# Altium schematic sheet Ethernet.SchDoc
size A3; SheetNumber: 6; SheetTotal: 15
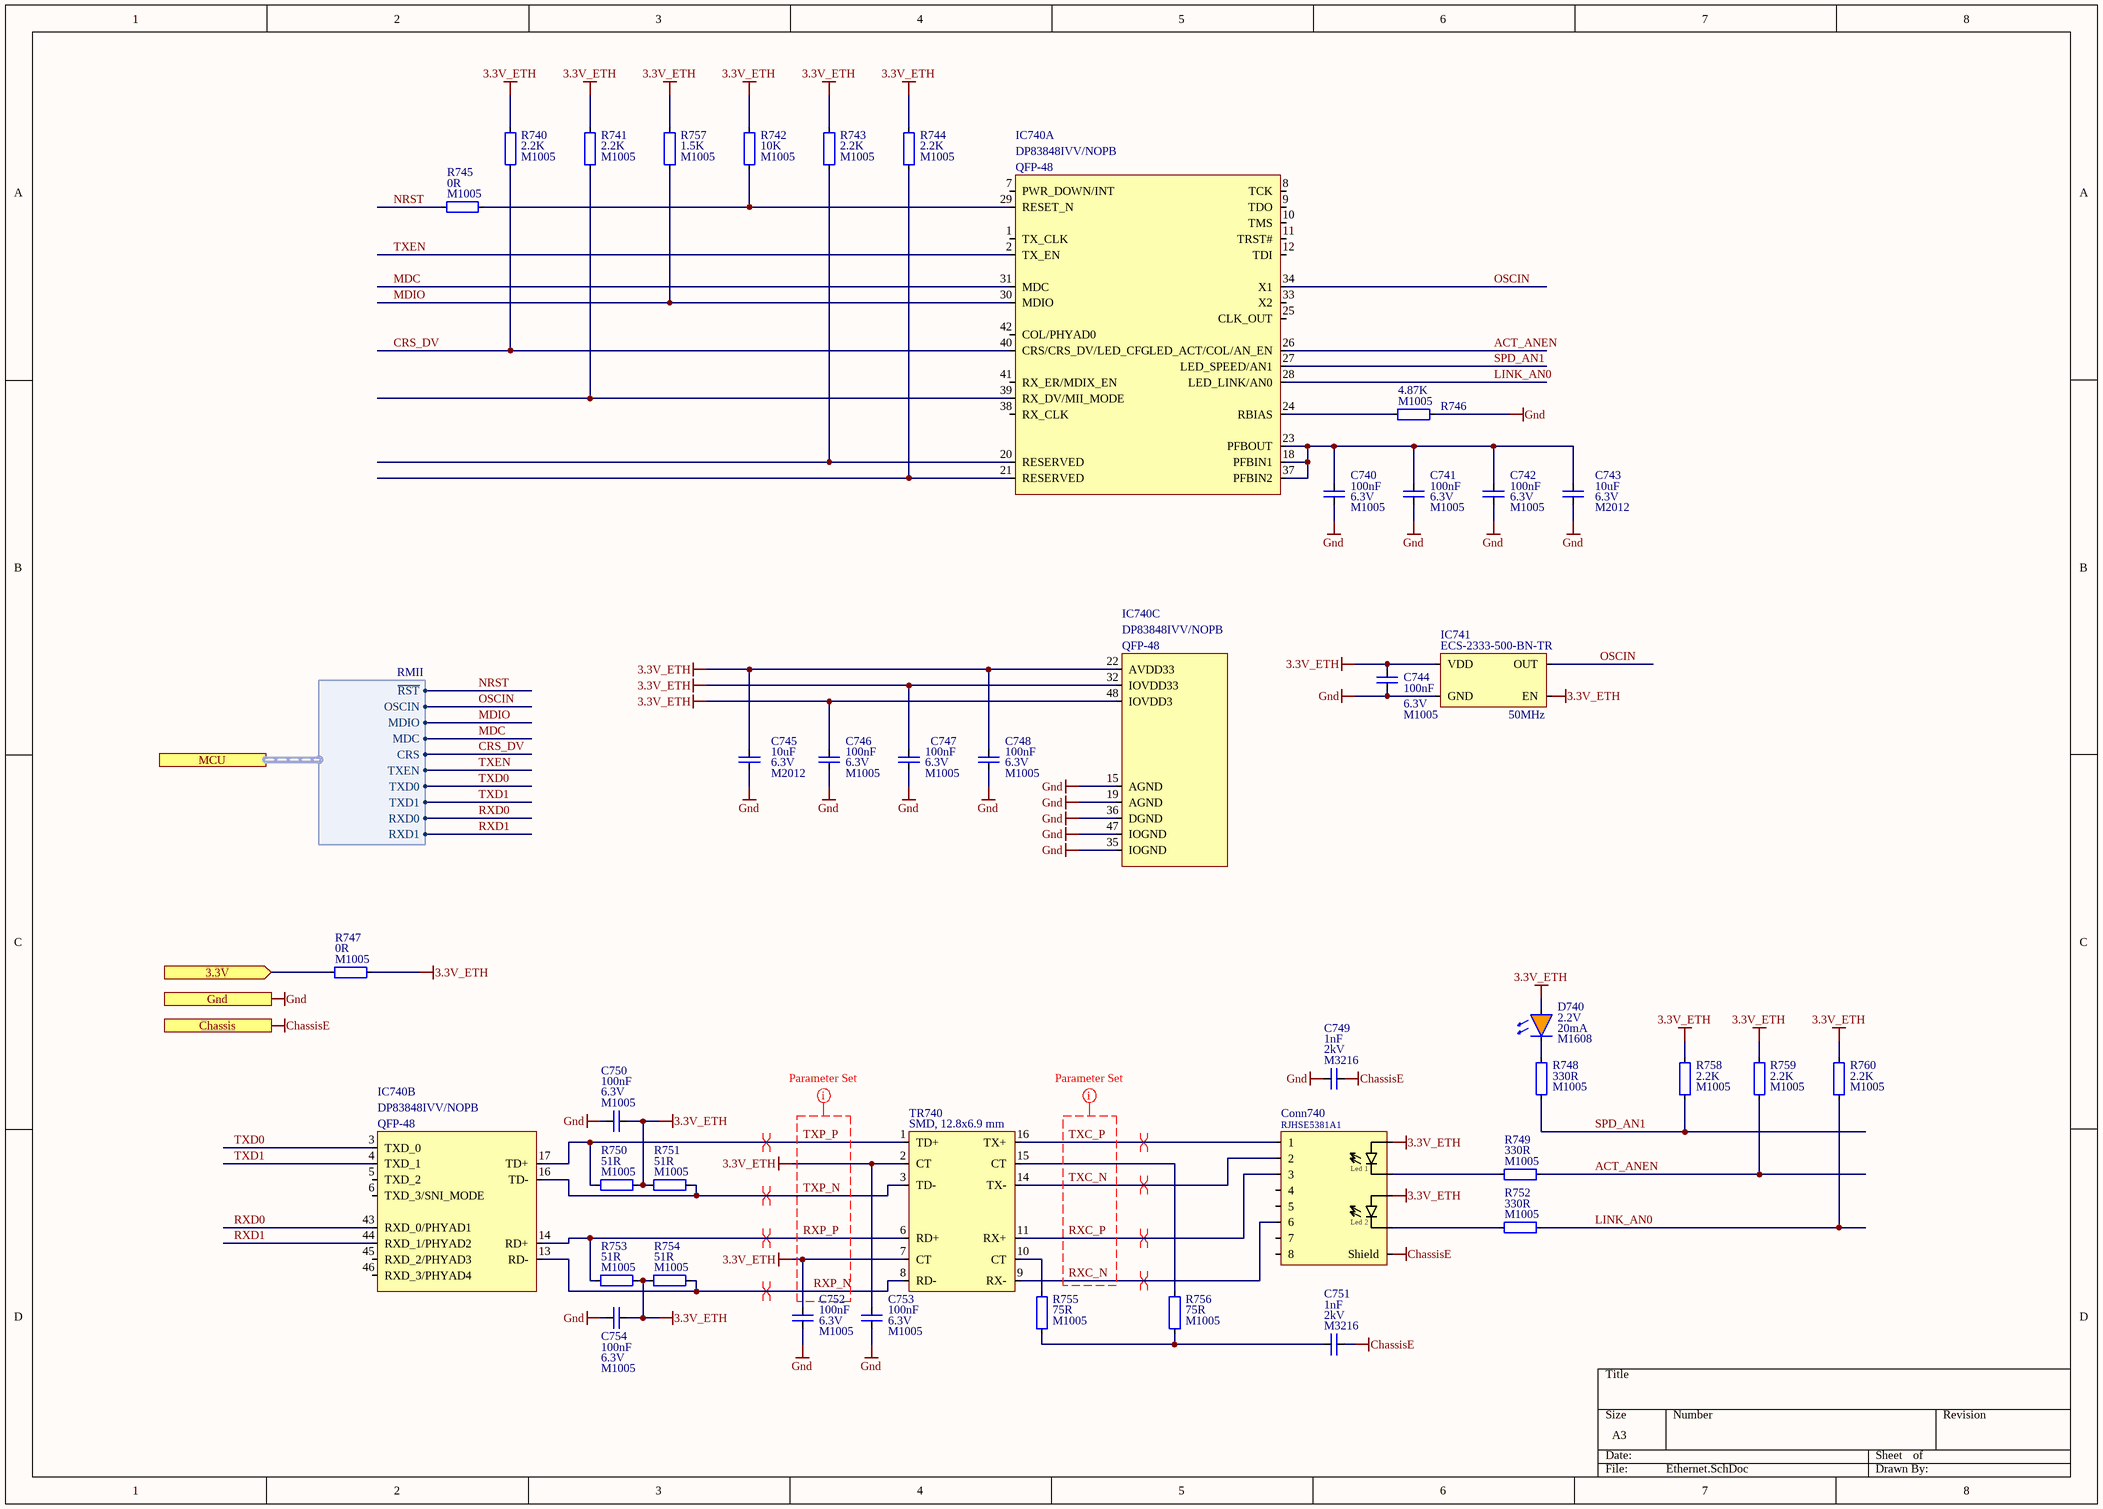
[diagram p0: Ethernet.SchDoc]

## Parts
C740  value 100nF  Voltage: 6.3V  Package: M1005  [Capacitor_Ceramic_M1005_I0402]  (hidden comment: Capacitor_Ceramic)
C741  value 100nF  Voltage: 6.3V  Package: M1005  [Capacitor_Ceramic_M1005_I0402]  (hidden comment: Capacitor_Ceramic)
C742  value 100nF  Voltage: 6.3V  Package: M1005  [Capacitor_Ceramic_M1005_I0402]  (hidden comment: Capacitor_Ceramic)
C743  value 10uF  Voltage: 6.3V  Package: M2012  [Capacitor_Ceramic_M2012_I0805]  (hidden comment: Capacitor_Ceramic)
C744  value 100nF  Voltage: 6.3V  Package: M1005  [Capacitor_Ceramic_M1005_I0402]  (hidden comment: Capacitor_Ceramic)
C745  value 10uF  Voltage: 6.3V  Package: M2012  [Capacitor_Ceramic_M2012_I0805]  (hidden comment: Capacitor_Ceramic)
C746  value 100nF  Voltage: 6.3V  Package: M1005  [Capacitor_Ceramic_M1005_I0402]  (hidden comment: Capacitor_Ceramic)
C747  value 100nF  Voltage: 6.3V  Package: M1005  [Capacitor_Ceramic_M1005_I0402]  (hidden comment: Capacitor_Ceramic)
C748  value 100nF  Voltage: 6.3V  Package: M1005  [Capacitor_Ceramic_M1005_I0402]  (hidden comment: Capacitor_Ceramic)
C749  value 1nF  Voltage: 2kV  Package: M3216  [Capacitor_Ceramic_M3216_I1206]  (hidden comment: Capacitor_Ceramic)
C750  value 100nF  Voltage: 6.3V  Package: M1005  [Capacitor_Ceramic_M1005_I0402]  (hidden comment: Capacitor_Ceramic)
C751  value 1nF  Voltage: 2kV  Package: M3216  [Capacitor_Ceramic_M3216_I1206]  (hidden comment: Capacitor_Ceramic)
C752  value 100nF  Voltage: 6.3V  Package: M1005  [Capacitor_Ceramic_M1005_I0402]  (hidden comment: Capacitor_Ceramic)
C753  value 100nF  Voltage: 6.3V  Package: M1005  [Capacitor_Ceramic_M1005_I0402]  (hidden comment: Capacitor_Ceramic)
C754  value 100nF  Voltage: 6.3V  Package: M1005  [Capacitor_Ceramic_M1005_I0402]  (hidden comment: Capacitor_Ceramic)
Conn740  Manufacturer Part Number: RJHSE5381A1  [RJ45 - Amphenol, RJHSE-x38x-A1]  (hidden comment: RJ45 - Amphenol, RJHSE-x38x-A1)
D740  Current: 20mA  Voltage: 2.2V  Package: M1608  [Diode_Smd_M1608_I0603_Orange1]  (hidden comment: Diode_Led)
IC740  Manufacturer Part Number: DP83848IVV/NOPB  Package: QFP-48  [QFP-48, 7mm x 7mm, 0.5mm]  (hidden comment: Ethernet - Texas, DP83848xVV)  (parts A,B,C of 3)
IC741  Frequency: 50MHz  Manufacturer Part Number: ECS-2333-500-BN-TR  [Clock Oscillator - ECS, ECS-2325, ECS-2333]  (hidden comment: Clock Oscillator - ECS, ECS-2325, ECS-2333)
R740  value 2.2K  Package: M1005  [Resistor_Smd_M1005_I0402]  (hidden comment: Resistor)
R741  value 2.2K  Package: M1005  [Resistor_Smd_M1005_I0402]  (hidden comment: Resistor)
R742  value 10K  Package: M1005  [Resistor_Smd_M1005_I0402]  (hidden comment: Resistor)
R743  value 2.2K  Package: M1005  [Resistor_Smd_M1005_I0402]  (hidden comment: Resistor)
R744  value 2.2K  Package: M1005  [Resistor_Smd_M1005_I0402]  (hidden comment: Resistor)
R745  value 0R  Package: M1005  [Resistor_Smd_M1005_I0402]  (hidden comment: Resistor)
R746  value 4.87K  Package: M1005  [Resistor_Smd_M1005_I0402]  (hidden comment: Resistor)
R747  value 0R  Package: M1005  [Resistor_Smd_M1005_I0402]  (hidden comment: Resistor)
R748  value 330R  Package: M1005  [Resistor_Smd_M1005_I0402]  (hidden comment: Resistor)
R749  value 330R  Package: M1005  [Resistor_Smd_M1005_I0402]  (hidden comment: Resistor)
R750  value 51R  Package: M1005  [Resistor_Smd_M1005_I0402]  (hidden comment: Resistor)
R751  value 51R  Package: M1005  [Resistor_Smd_M1005_I0402]  (hidden comment: Resistor)
R752  value 330R  Package: M1005  [Resistor_Smd_M1005_I0402]  (hidden comment: Resistor)
R753  value 51R  Package: M1005  [Resistor_Smd_M1005_I0402]  (hidden comment: Resistor)
R754  value 51R  Package: M1005  [Resistor_Smd_M1005_I0402]  (hidden comment: Resistor)
R755  value 75R  Package: M1005  [Resistor_Smd_M1005_I0402]  (hidden comment: Resistor)
R756  value 75R  Package: M1005  [Resistor_Smd_M1005_I0402]  (hidden comment: Resistor)
R757  value 1.5K  Package: M1005  [Resistor_Smd_M1005_I0402]  (hidden comment: Resistor)
R758  value 2.2K  Package: M1005  [Resistor_Smd_M1005_I0402]  (hidden comment: Resistor)
R759  value 2.2K  Package: M1005  [Resistor_Smd_M1005_I0402]  (hidden comment: Resistor)
R760  value 2.2K  Package: M1005  [Resistor_Smd_M1005_I0402]  (hidden comment: Resistor)
TR740  Package: SMD, 12.8x6.9 mm  [Transformer, Pulse - Bourns, SM13126PEL]  (hidden comment: Transformer, Pulse - Bourns, SM13126PEL)

## Ports
3.3V (in), Chassis (in), Gnd (in), MCU (harness RMII)

## Harnesses
RMII: ~{RST}, OSCIN, MDIO, CRS, MDC, TXEN, TXD0, TXD1, RXD0, RXD1

## Nets
3.3V_ETH: C744.1 C745.1 C746.1 C747.1 C748.1 C750.2 C752.1 C753.1 C754.2 Conn740.L1-A Conn740.L2-A D740.A IC740.22(AVDD33) IC740.32(IOVDD33) IC740.48(IOVDD3) IC741.EN IC741.VDD R740.1 R741.1 R742.1 R743.1 R744.1 R747.2 R750.2 R751.1 R753.2 R754.1 R757.1 R758.1 R759.1 R760.1 TR740.2(CT) TR740.7(CT)
ChassisE: C749.2 C751.2 Conn740.Shield ; port Chassis
Gnd: C740.2 C741.2 C742.2 C743.2 C744.2 C745.2 C746.2 C747.2 C748.2 C749.1 C750.1 C752.2 C753.2 C754.1 IC740.15(AGND) IC740.19(AGND) IC740.35(IOGND) IC740.36(DGND) IC740.47(IOGND) IC741.GND R746.2 ; port Gnd
3.3V: R747.1 ; port 3.3V
ACT_ANEN: IC740.26(LED_ACT/COL/AN_EN) R749.2 R759.2
CRS_DV: IC740.40(CRS/CRS_DV/LED_CFG) R740.2 ; port MCU.CRS
LINK_AN0: IC740.28(LED_LINK/AN0) R752.2 R760.2
MDC: IC740.31(MDC) ; port MCU.MDC
MDIO: IC740.30(MDIO) R757.2 ; port MCU.MDIO
NRST: R745.1 ; port MCU.~{RST}
OSCIN: IC740.34(X1) IC741.OUT ; port MCU.OSCIN
RXC_N: Conn740.6 TR740.9(RX-)
RXC_P: Conn740.3 TR740.11(RX+)
RXD0: IC740.43(RXD_0/PHYAD1) ; port MCU.RXD0
RXD1: IC740.44(RXD_1/PHYAD2) ; port MCU.RXD1
RXP_N: IC740.13(RD-) R754.2 TR740.8(RD-)
RXP_P: IC740.14(RD+) R753.1 TR740.6(RD+)
SPD_AN1: IC740.27(LED_SPEED/AN1) R748.2 R758.2
TXC_N: Conn740.2 TR740.14(TX-)
TXC_P: Conn740.1 TR740.16(TX+)
TXD0: IC740.3(TXD_0) ; port MCU.TXD0
TXD1: IC740.4(TXD_1) ; port MCU.TXD1
TXEN: IC740.2(TX_EN) ; port MCU.TXEN
TXP_N: IC740.16(TD-) R751.2 TR740.3(TD-)
TXP_P: IC740.17(TD+) R750.1 TR740.1(TD+)
NetC740_1: C740.1 C741.1 C742.1 C743.1 IC740.18(PFBIN1) IC740.23(PFBOUT) IC740.37(PFBIN2)
NetC751_1: C751.1 R755.2 R756.2
NetConn740_L1-C: Conn740.L1-C R749.1
NetConn740_L2-C: Conn740.L2-C R752.1
NetD740_C: D740.C R748.1
NetIC740_20: IC740.20(RESERVED) R743.2
NetIC740_21: IC740.21(RESERVED) R744.2
NetIC740_24: IC740.24(RBIAS) R746.1
NetIC740_29: IC740.29(RESET_N) R742.2 R745.2
NetIC740_39: IC740.39(RX_DV/MII_MODE) R741.2
NetR755_1: R755.1 TR740.10(CT)
NetR756_1: R756.1 TR740.15(CT)

Not connected (* = marked no-connect by the designer): Conn740 4 5 7 8; IC740 1(TX_CLK) 5(TXD_2) 6(TXD_3/SNI_MODE) 7(PWR_DOWN/INT) 8(TCK) 9(TDO) 10(TMS) 11(TRST#) 12(TDI) 25(CLK_OUT) 33(X2) 38(RX_CLK) 41(RX_ER/MDIX_EN) 42(COL/PHYAD0) 45(RXD_2/PHYAD3) 46(RXD_3/PHYAD4)

## Layout directives
differential pair; differential pair class Eth_100: RXC_N, RXC_P, RXP_N, RXP_P, TXC_N, TXC_P, TXP_N, TXP_P
net class EthP: RXP_N, RXP_P, TXP_N, TXP_P
net class EthC: RXC_N, RXC_P, TXC_N, TXC_P

## Notes on the sheet
- (in symbol RJ45 - Amphenol, RJHSE-x38x-A1) Led 1; Led 2

## Library data of the parts
C740-C742 C744 C746-C748 C750 C752-C754 = Capacitor_Ceramic: Cap, Cer, 100nF, 6.3V, M1005; Manufacturer Part Number: 04026D104KAT4A; Manufacturer: Kyocera; Temperature Coefficient: X5R; Tolerance: 10%; ComponentLink1Description: Datasheet; ComponentLink1URL: E:\Altium\Datasheets\Capacitor\Kyocera - X5R.pdf; ComponentLink2Description: Supplier Link; ComponentLink2URL: https://www.digikey.com/en/products/detail/kyocera-avx/04026D104KAT4A/8107673; Supplier: Digikey; Supplier Part Number: 478-11504-1-ND; Operating Temperature, Min: +85℃; Operating Temperature, Max: -55℃; Quantity, Min: 1; Quantity, Max: 250000; Price, Min: 0.1; Supplier Currency: $; Price, Max: 0.00189; Supplier Link: https://www.digikey.com/en/products/detail/kyocera-avx/04026D104KAT4A/8107673; Component Type: Ceramic; Component Category: Capacitor
C743 C745 = Capacitor_Ceramic: Cap, Cer, 10uF, 6.3V, M2012; Manufacturer Part Number: CL21A106MQFNNNE; Manufacturer: Samsung; Temperature Coefficient: X5R; Tolerance: 20%; ComponentLink1Description: Datasheet; ComponentLink1URL: E:\Altium\Datasheets\Capacitor\Samsung - Multi Layer Ceramic Capacitors.pdf; ComponentLink2Description: Supplier Link; ComponentLink2URL: https://www.digikey.com/en/products/detail/samsung-electro-mechanics/CL21A106MQFNNNE/3886956; Supplier: Digikey; Supplier Part Number: 1276-1298-1-ND; Operating Temperature, Min: +85℃; Operating Temperature, Max: -55℃; Quantity, Min: 1; Quantity, Max: 200000; Price, Min: 0.1; Supplier Currency: $; Price, Max: 0.0087; Supplier Link: https://www.digikey.com/en/products/detail/samsung-electro-mechanics/CL21A106MQFNNNE/3886956; Component Type: Ceramic; Component Category: Capacitor
C749 C751 = Capacitor_Ceramic: Cap, Cer, 1nF, 2kV, M3216; Manufacturer Part Number: CC1206MKX7RDBB102; Manufacturer: Yageo; Temperature Coefficient: X7R; Tolerance: 20%; ComponentLink1Description: Datasheet; ComponentLink1URL: E:\Altium\Datasheets\Capacitor\Yageo - Surface-Mount Ceramic Multilayer Capacitors.pdf; ComponentLink2Description: Supplier Link; ComponentLink2URL: https://www.digikey.com/en/products/detail/yageo/CC1206MKX7RDBB102/5884663; Supplier: Digikey; Supplier Part Number: 311-4501-1-ND; Operating Temperature, Min: +125℃; Operating Temperature, Max: -55℃; Quantity, Min: 1; Quantity, Max: 300000; Price, Min: 0.23; Supplier Currency: $; Price, Max: 0.03271; Supplier Link: https://www.digikey.com/en/products/detail/yageo/CC1206MKX7RDBB102/5884663; Component Type: Ceramic; Component Category: Capacitor
Conn740 = RJ45 - Amphenol, RJHSE-x38x-A1: Conn, RJ45, 2 Leds, Shielded, Side Entry; Component Category: Connector; ComponentLink1Description: Datasheet; ComponentLink1URL: E:\Altium\Datasheets\Connector - Registered Jack\RJ45 - Amphenol, RJHSE-x38x-A1.pdf; ComponentLink2Description: Supplier Link; ComponentLink2URL: https://www.digikey.com/en/products/detail/amphenol-cs-commercial-products/RJHSE5381A1/3083556; Supplier: Digikey; Supplier Part Number: RJHSE5381A1-ND; Manufacturer: Amphenol; Operating Temperature, Min: -55℃; Operating Temperature, Max: +85℃; Quantity, Min: 1; Quantity, Max: 2400; Price, Min: 1.51; Supplier Currency: $; Price, Max: 0.806; Supplier Link: https://www.digikey.com/en/products/detail/amphenol-cs-commercial-products/RJHSE5381A1/3083556; Component Type: PCB; Package: RJ45
D740 = Diode_Led: Diode, Led, Orange, 2.2V, 20mA, M1608; Manufacturer Part Number: SML-D12D1WT86; Manufacturer: Rohm; ComponentLink1Description: Datasheet; ComponentLink1URL: E:\Altium\Datasheets\Diode\Rohm, SML-D12x1 Series.pdf; ComponentLink2Description: Supplier Link; ComponentLink2URL: https://www.digikey.com/en/products/detail/rohm-semiconductor/SML-D12D1WT86/5843854; Supplier: Digikey; Supplier Part Number: SML-D12D1WT86CT-ND; Operating Temperature, Min: -40℃; Operating Temperature, Max: +85℃; Quantity, Min: 1; Quantity, Max: 75000; Price, Min: 0.25; Price, Max: 0.02838; Supplier Currency: $; Supplier Link: https://www.digikey.com/en/products/detail/rohm-semiconductor/SML-D12D1WT86/5843854; Component Type: Led; Component Category: Diode
IC740 = Ethernet - Texas, DP83848xVV: IC, Interface, Eth Phy, 10/100Mb, DP83848IVV; ComponentLink1Description: Datasheet; ComponentLink1URL: E:\Altium\Datasheets\IC - Interface\Ethernet - Texas, DP83848.pdf; ComponentLink2Description: Supplier Link; ComponentLink2URL: https://www.digikey.com/en/products/detail/texas-instruments/DP83848IVV-NOPB/947543; Supplier: Digikey; Supplier Part Number: DP83848IVV/NOPB-ND; Manufacturer: Texas; Operating Temperature, Min: -40℃; Operating Temperature, Max: +85℃; Quantity, Min: 1; Quantity, Max: 1000; Price, Min: 6.45; Supplier Currency: $; Price, Max: 3.834; Supplier Link: https://www.digikey.com/en/products/detail/texas-instruments/DP83848IVV-NOPB/947543; Component Type: Interface; Component Category: IC
IC741 = Clock Oscillator - ECS, ECS-2325, ECS-2333: IC, Oscillator, 50MHz; ComponentLink1Description: Datasheet; ComponentLink1URL: E:\Altium\Datasheets\IC - Clock, Timing, Oscillator\Clock Oscillator - ECS, ECS-2325, ECS-2333.pdf; ComponentLink2Description: Supplier Link; ComponentLink2URL: https://www.digikey.com/en/products/detail/ecs-inc/ECS-2333-500-BN-TR/3927356; Supplier: Digikey; Supplier Part Number: XC1930CT-ND; Operating Temperature, Min: -40℃; Operating Temperature, Max: +85℃; Quantity, Min: 1; Quantity, Max: 10000; Price, Min: 1.24; Supplier Currency: $; Price, Max: 0.71656; Supplier Link: https://www.digikey.com/en/products/detail/ecs-inc/ECS-2333-500-BN-TR/3927356; Component Type: Clock, Timing, Oscillator; Component Category: IC; Manufacturer: ECS; Package: Flat, 3.2mm x 2.5mm
R740 R741 R743 R744 R758-R760 = Resistor: Res, 2.2K, 1%, M1005; Manufacturer: Yageo; Manufacturer Part Number: RC0402FR-072K2L; Component Category: Resistor; Component Type: Fixed Value; Tolerance: 1%; Supplier Link: https://www.digikey.com/en/products/detail/yageo/RC0402FR-072K2L/726553; Supplier Currency: $; Price, Max: 0.00129; Price, Min: 0.1; Quantity, Max: 100000; Quantity, Min: 1; Operating Temperature, Max: -55℃; Operating Temperature, Min: +155℃; Supplier Part Number: 311-2.20KLRCT-ND; Supplier: Digikey; ComponentLink1Description: Datasheet; ComponentLink1URL: E:\Altium\Datasheets\Resistor\Yageo - RC_L Series.pdf; ComponentLink2Description: Supplier Link; ComponentLink2URL: https://www.digikey.com/en/products/detail/yageo/RC0402FR-072K2L/726553
R742 = Resistor: Res, 10K, 1%, M1005; Manufacturer: Yageo; Manufacturer Part Number: RC0402FR-0710KP; Component Category: Resistor; Component Type: Fixed Value; Tolerance: 1%; Supplier Link: https://www.digikey.com/en/products/detail/yageo/RC0402FR-0710KP/4935264; Supplier Currency: $; Price, Max: 0.00282; Price, Min: 0.1; Quantity, Max: 100000; Quantity, Min: 1; Operating Temperature, Max: -55℃; Operating Temperature, Min: +155℃; Supplier Part Number: YAG1249CT-ND; Supplier: Digikey; ComponentLink1Description: Datasheet; ComponentLink1URL: E:\Altium\Datasheets\Resistor\Yageo - RC_L Series.pdf; ComponentLink2Description: Supplier Link; ComponentLink2URL: https://www.digikey.com/en/products/detail/yageo/RC0402FR-0710KP/4935264
R745 R747 = Resistor: Res, 0R, M1005; Manufacturer: Yageo; Manufacturer Part Number: RC0402FR-070RL; Component Category: Resistor; Component Type: Fixed Value; Tolerance: *; Supplier Link: https://www.digikey.com/en/products/detail/yageo/RC0402FR-070RL/2827570; Supplier Currency: $; Price, Max: 0.00109; Price, Min: 0.1; Quantity, Max: 50000; Quantity, Min: 1; Operating Temperature, Max: -55℃; Operating Temperature, Min: +155℃; Supplier Part Number: 311-0.0LRCT-ND; Supplier: Digikey; ComponentLink1Description: Datasheet; ComponentLink1URL: E:\Altium\Datasheets\Resistor\Yageo - RC_L Series.pdf; ComponentLink2Description: Supplier Link; ComponentLink2URL: https://www.digikey.com/en/products/detail/yageo/RC0402FR-070RL/2827570
R746 = Resistor: Res, 4.87K, 1%, M1005; Manufacturer: Yageo; Manufacturer Part Number: RC0402FR-074K87L; Component Category: Resistor; Component Type: Fixed Value; Tolerance: 1%; Supplier Link: https://www.digikey.com/en/products/detail/yageo/RC0402FR-074K87L/5281035; Supplier Currency: $; Price, Max: 0.00129; Price, Min: 0.1; Quantity, Max: 100000; Quantity, Min: 1; Operating Temperature, Max: -55℃; Operating Temperature, Min: +155℃; Supplier Part Number: YAG3175CT-ND; Supplier: Digikey; ComponentLink1Description: Datasheet; ComponentLink1URL: E:\Altium\Datasheets\Resistor\Yageo - RC_L Series.pdf; ComponentLink2Description: Supplier Link; ComponentLink2URL: https://www.digikey.com/en/products/detail/yageo/RC0402FR-074K87L/5281035
R748 R749 R752 = Resistor: Res, 330R, 1%, M1005; Manufacturer: Yageo; Manufacturer Part Number: RC0402FR-07330RL; Component Category: Resistor; Component Type: Fixed Value; Tolerance: 1%; Supplier Link: https://www.digikey.com/en/products/detail/yageo/RC0402FR-07330RL/726594; Supplier Currency: $; Price, Max: 0.00129; Price, Min: 0.1; Quantity, Max: 100000; Quantity, Min: 1; Operating Temperature, Max: -55℃; Operating Temperature, Min: +155℃; Supplier Part Number: 311-330LRCT-ND; Supplier: Digikey; ComponentLink1Description: Datasheet; ComponentLink1URL: E:\Altium\Datasheets\Resistor\Yageo - RC_L Series.pdf; ComponentLink2Description: Supplier Link; ComponentLink2URL: https://www.digikey.com/en/products/detail/yageo/RC0402FR-07330RL/726594
R750 R751 R753 R754 = Resistor: Res, 51R, 1%, M1005; Manufacturer: Yageo; Manufacturer Part Number: RC0402FR-0751RL; Component Category: Resistor; Component Type: Fixed Value; Tolerance: 1%; Supplier Link: https://www.digikey.com/en/products/detail/yageo/RC0402FR-0751RL/726629; Supplier Currency: $; Price, Max: 0.00129; Price, Min: 0.1; Quantity, Max: 100000; Quantity, Min: 1; Operating Temperature, Max: -55℃; Operating Temperature, Min: +155℃; Supplier Part Number: 311-51.0LRCT-ND; Supplier: Digikey; ComponentLink1Description: Datasheet; ComponentLink1URL: E:\Altium\Datasheets\Resistor\Yageo - RC_L Series.pdf; ComponentLink2Description: Supplier Link; ComponentLink2URL: https://www.digikey.com/en/products/detail/yageo/RC0402FR-0751RL/726629
R755 R756 = Resistor: Res, 75R, 1%, M1005; Manufacturer: Yageo; Manufacturer Part Number: RC0402FR-0775RL; Component Category: Resistor; Component Type: Fixed Value; Tolerance: 1%; Supplier Link: https://www.digikey.com/en/products/detail/yageo/RC0402FR-0775RL/726658; Supplier Currency: $; Price, Max: 0.00129; Price, Min: 0.1; Quantity, Max: 100000; Quantity, Min: 1; Operating Temperature, Max: -55℃; Operating Temperature, Min: +155℃; Supplier Part Number: 311-75.0LRCT-ND; Supplier: Digikey; ComponentLink1Description: Datasheet; ComponentLink1URL: E:\Altium\Datasheets\Resistor\Yageo - RC_L Series.pdf; ComponentLink2Description: Supplier Link; ComponentLink2URL: https://www.digikey.com/en/products/detail/yageo/RC0402FR-0775RL/726658
R757 = Resistor: Res, 1.5K, 1%, M1005; Manufacturer: Yageo; Manufacturer Part Number: RC0402FR-071K5L; Component Category: Resistor; Component Type: Fixed Value; Tolerance: 1%; Supplier Link: https://www.digikey.com/en/products/detail/yageo/RC0402FR-071K5L/726519; Supplier Currency: $; Price, Max: 0.00129; Price, Min: 0.1; Quantity, Max: 100000; Quantity, Min: 1; Operating Temperature, Max: -55℃; Operating Temperature, Min: +155℃; Supplier Part Number: 311-1.50KLRCT-ND; Supplier: Digikey; ComponentLink1Description: Datasheet; ComponentLink1URL: E:\Altium\Datasheets\Resistor\Yageo - RC_L Series.pdf; ComponentLink2Description: Supplier Link; ComponentLink2URL: https://www.digikey.com/en/products/detail/yageo/RC0402FR-071K5L/726519
TR740 = Transformer, Pulse - Bourns, SM13126PEL: Transformer, Eth, 100Mbps, SM13126PEL; ComponentLink1Description: Datasheet; ComponentLink1URL: E:\Altium\Datasheets\Transformer\Transformer, Pulse - Bourns, SM51108PEL.pdf; ComponentLink2Description: Supplier Link; ComponentLink2URL: https://www.digikey.com/en/products/detail/bourns-inc/SM13126PEL/10229989; Manufacturer Part Number: SM13126PEL; Supplier: Digikey; Supplier Part Number: SM13126PELCT-ND; Manufacturer: Bourns; Operating Temperature, Min: -40℃; Operating Temperature, Max: +85℃; Quantity, Min: 1; Quantity, Max: 6000; Price, Min: 2.17; Price, Max: 1.05049; Supplier Currency: $; Supplier Link: https://www.digikey.com/en/products/detail/bourns-inc/SM13126PEL/10229989; Component Type: Pulse; Component Category: Transformer